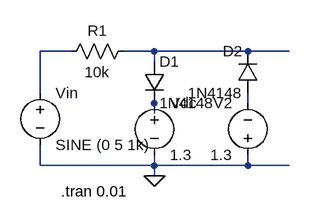
[diagram p0: schematic ερώτημα 17.asc]
ερώτημα 17.asc, the LTspice schematic file:
Version 4
SHEET 1 880 680
WIRE -48 48 -96 48
WIRE 80 48 32 48
WIRE 224 48 80 48
WIRE 288 48 224 48
WIRE 80 64 80 48
WIRE -96 112 -96 48
WIRE 224 128 224 112
WIRE 80 144 80 128
WIRE -96 224 -96 192
WIRE 80 224 80 208
WIRE 80 224 -96 224
WIRE 224 224 224 208
WIRE 224 224 80 224
WIRE 288 224 224 224
WIRE 80 240 80 224
FLAG 80 240 0
SYMBOL res 48 32 R90
WINDOW 0 0 56 VBottom 2
WINDOW 3 32 56 VTop 2
SYMATTR InstName R1
SYMATTR Value 10k
SYMBOL diode 64 64 R0
SYMATTR InstName D1
SYMATTR Value 1N4148
SYMBOL voltage 80 112 R0
SYMATTR InstName Vdc
SYMATTR Value 1.3
SYMBOL voltage -96 96 R0
SYMATTR InstName Vin
SYMATTR Value SINE (0 5 1k)
SYMBOL voltage 224 224 R180
WINDOW 0 24 96 Left 2
WINDOW 3 24 16 Left 2
SYMATTR InstName V2
SYMATTR Value 1.3
SYMBOL diode 240 112 R180
WINDOW 0 24 64 Left 2
WINDOW 3 24 0 Left 2
SYMATTR InstName D2
SYMATTR Value 1N4148
TEXT -64 264 Left 2 !.tran 0.01

The netlist it stands for:
* ερώτημα 17.asc
R1 N002 N001 10k
D1 N002 N004 1N4148
Vdc N004 0 1.3
Vin N001 0 SINE (0 5 1k)
V2 0 N003 1.3
D2 N003 N002 1N4148
.model D D
.lib standard.dio
.tran 0.01
.backanno
.end